# Altium schematic sheet Senior-Analog-batteryrecharge.SchDoc
size B
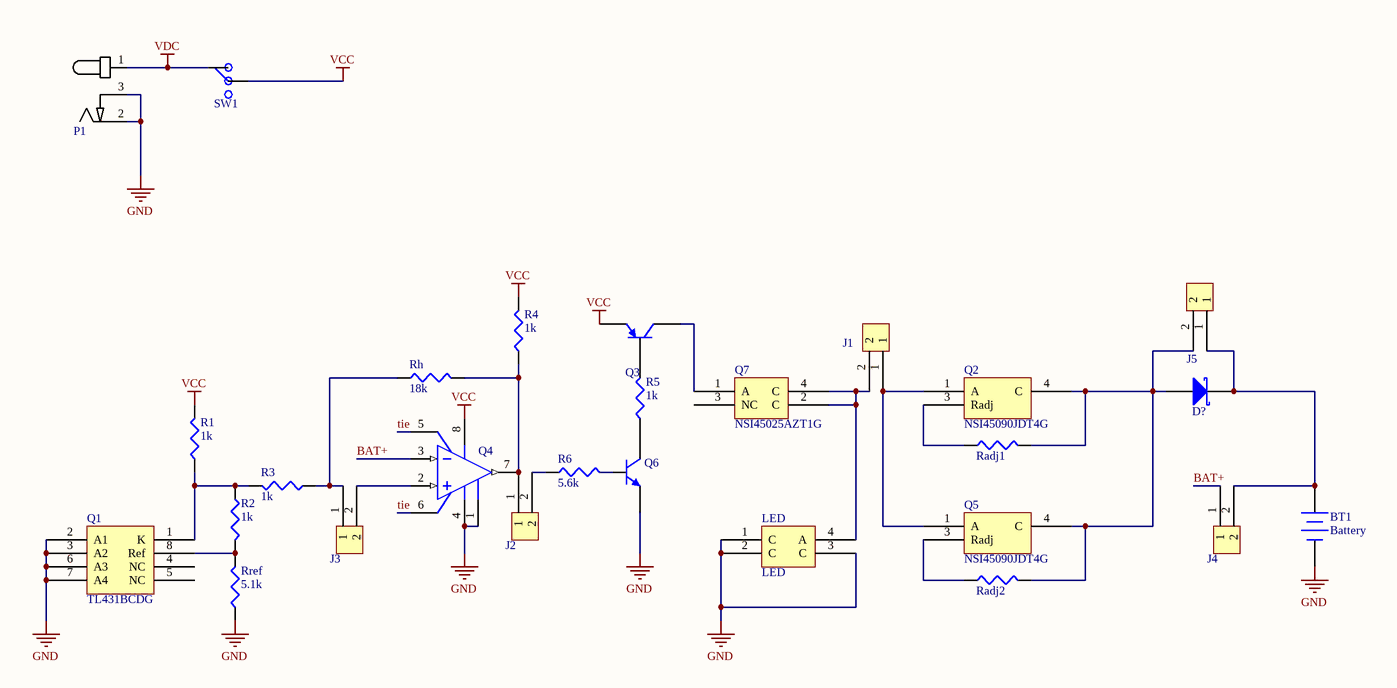
[diagram p0: Senior-Analog-batteryrecharge.SchDoc]

## Parts
BT1  Battery  [BAT-2]
D?  DB2J20600L  [SODFL250X70-2N]  (value not drawn)
J1  2-pin Jumper  [2-pin-jumper]  (value not drawn)
J2  2-pin Jumper  [2-pin-jumper]  (value not drawn)
J3  2-pin Jumper  [2-pin-jumper]  (value not drawn)
J4  2-pin Jumper  [2-pin-jumper]  (value not drawn)
J5  2-pin Jumper  [2-pin-jumper]  (value not drawn)
LED  LS E67B-S2V1-1-1-Z  [OSRAM_LED]  (value not drawn)
P1  PJ-002BH  [PJ-002BH]  (value not drawn)
Q1  TL431BCDG  [SOIC127P600X175-8N]
Q2  NSI45090JDT4G  [DPAK229P991X238-3N]
Q3  NSS40200LT1G  [SOT95P245X110-3N]  (value not drawn)
Q4  LM311DR2G  [SOIC127P600X175-8N]  (value not drawn)
Q5  NSI45090JDT4G  [DPAK229P991X238-3N]
Q6  MMBT3904LT3G  [SOT95P245X110-3N]  (value not drawn)
Q7  NSI45025AZT1G  [SOT230P700X180-4N]
R1  Resistance (Ohms): 1k  [R0805]  (hidden comment: RC0805FR-071KL)
R2  Resistance (Ohms): 1k  [R0805]  (hidden comment: RC0805FR-071KL)
R3  Resistance (Ohms): 1k  [R0805]  (hidden comment: RC0805FR-071KL)
R4  Resistance (Ohms): 1k  [R1206]  (hidden comment: RC1206FR-071KL)
R5  Resistance (Ohms): 1k  [R1206]  (hidden comment: RC1206FR-071KL)
R6  Resistance (Ohms): 5.6k  [R0805]  (hidden comment: RC0805FR-075K6L)
Radj1  R1210_generic  [R1210]  (value not drawn)
Radj2  R1210_generic  [R1210]  (value not drawn)
Rh  Resistance (Ohms): 18k  [R0805]  (hidden comment: RC0805FR-0718KL)
Rref  Resistance (Ohms): 5.1k  [R0805]  (hidden comment: RC0805FR-075K1L)
SW1  MS12ANW03  [SPDT SWITCH]  (value not drawn)

## Nets
GND: BT1.2(-) LED.1(C) LED.2(C) LED.3(C) P1.2 P1.3 Q1.2(A1) Q1.3(A2) Q1.6(A3) Q1.7(A4) Q4.1(GND) Q4.4(VEE) Q6.2(E) Rref.1
VCC: Q3.2(E) Q4.8(VCC) R1.2 R4.2 SW1.2(OUT)
VDC: P1.1 SW1.1(IN)
BAT+: J4.1 Q4.3(IN+)
tie: Q4.5(BAL) Q4.6(BAL)
NetBT1_1: BT1.1(+) D?.1(K) J4.2 J5.1
NetD?_2: D?.2(A) J5.2 Q2.4(C) Q5.4(C) Radj1.2 Radj2.2
NetJ1_1: J1.1 Q2.1(A) Q5.1(A)
NetJ1_2: J1.2 LED.4(A) Q7.2(C) Q7.4(C)
NetJ2_1: J2.1 Q4.7(Out) R4.1 Rh.2
NetJ2_2: J2.2 R6.1
NetJ3_1: J3.1 R3.1 Rh.1
NetJ3_2: J3.2 Q4.2(IN-)
NetQ1_1: Q1.1(K) R1.1 R2.1 R3.2
NetQ1_8: Q1.8(Ref) R2.2 Rref.2
NetQ2_3: Q2.3(Radj) Radj1.1
NetQ3_1: Q3.1(B) R5.2
NetQ3_3: Q3.3(C) Q7.1(A)
NetQ5_3: Q5.3(Radj) Radj2.1
NetQ6_1: Q6.1(B) R6.2
NetQ6_3: Q6.3(C) R5.1

Not connected (* = marked no-connect by the designer): Q1 4(NC) 5(NC); Q7 3(NC)

## Library data of the parts
BT1 = Battery: Multicell Battery; Published: 24-Mar-1999; LatestRevisionDate: 17-Jul-2002; LatestRevisionNote: Re-released for DXP Platform.; PackageReference: BAT-2; Publisher: Altium Limited; PackageDescription: Battery; 2 Leads
D? = DB2J20600L: DIODE SCHOTTKY 20V 1A SMINI2; Manufacturer: Panasonic Electronic Components; Voltage - Forward (Vf) (Max) @ If: 450mV @ 1A; Speed: Fast Recovery =< 500ns, > 200mA (Io); Reverse Recovery Time (trr): 6ns; Current - Reverse Leakage @ Vr: 100µA @ 20V; Capacitance @ Vr, F: 20pF @ 10V, 1MHz; Supplier 1: Digi-Key; Manufacturer Part Number: DB2J20600L; RoHS: RoHS Compliant; Category: Discrete Semiconductor Products; Stock 1: 1938; Pricing 1: 1=0.17, 10=0.145, 25=0.1168, 100=0.0909, 250=0.08828, 500=0.08566, 1000=0.07788 (USD); Packaging: Cut Tape (CT); Diode Type: Schottky; Voltage - DC Reverse (Vr) (Max): 20V; Current - Average Rectified (Io): 1A; Mounting Type: Surface Mount; Package / Case: SC-90, SOD-323F; Supplier Device Package: SMini2-F5-B; Operating Temperature - Junction: 150°C (Max); ComponentLink1URL: http://industrial.panasonic.com/www-cgi/jvcr13pz.cgi?E+SC+4+CDF7001+DB2J206+8+WW; ComponentLink1Description: http://industrial.panasonic.com/www-cgi/jvcr13pz.cgi?E+SC+4+CDF7001+DB2J206+8+WW; Supplier Part Number 1: DB2J20600LCT-ND
LED = LS E67B-S2V1-1-1-Z: LED RED CLEAR 4PLCC SMD; Manufacturer: OSRAM Opto Semiconductors Inc.; Lens Color: Colorless; Millicandela Rating: 562mcd; Lens Style/Size: Round with Flat Top, 2.40mm; Voltage - Forward (Vf) (Typ): 2.2V; Current - Test: 50mA; Viewing Angle: 120°; Wavelength - Dominant: 633nm; Wavelength - Peak: 645nm; Supplier 1: Digi-Key; Manufacturer Part Number: LS E67B-S2V1-1-1-Z; RoHS: RoHS Compliant; Category: Optoelectronics; Stock 1: 21300; Pricing 1: 1=0.41, 10=0.316, 25=0.2576, 100=0.2048, 250=0.17556, 500=0.15216, 1000=0.11705 (USD); Packaging: Cut Tape (CT); Color: Red; Lens Transparency: Clear; Mounting Type: Surface Mount; Features: -; Package / Case: 4-PLCC; Supplier Device Package: 4-PLCC; Size / Dimension: 3.20mm L x 2.80mm W; Height (Max): 2.10mm; ComponentLink1URL: http://www.osram-os.com/Graphics/XPic8/00090423_0.pdf; ComponentLink1Description: http://www.osram-os.com/Graphics/XPic8/00090423_0.pdf; Supplier Part Number 1: 475-2505-1-ND
P1 = PJ-002BH: CONN PWR JACK 2.5X5.5MM HIGH CUR; Manufacturer: CUI Inc.; Gender: Male; Plug/Mating Plug Diameter: 2.5mm ID, 5.5mm OD; Number of Positions/Contacts: 2 Conductors, 3 Contacts; Internal Switch(s): Single Switch, Normally Closed; Shielding: Unshielded; Voltage - Rated: 24VDC; Current Rating: 5A; Supplier 1: Digi-Key; Manufacturer Part Number: PJ-002BH; RoHS: RoHS Compliant; Category: Connectors, Interconnects; Stock 1: 55516; Pricing 1: 1=1.16, 10=0.812, 100=0.5452, 500=0.4408, 1000=0.3944, 2500=0.3132 (USD); Connector Type: Jack; Mounting Type: Through Hole, Right Angle; Termination: Solder Eyelet(s); Features: -; Color: Black; Contact Material: Copper Alloy; Contact Material - Plating: Nickel; Housing Color: Black; Housing Material: Thermoplastic; Operating Temperature: -25°C ~ 85°C; ComponentLink1URL: http://www.cui.com/product/resource/digikeypdf/pj-002bh.pdf; ComponentLink1Description: http://www.cui.com/product/resource/digikeypdf/pj-002bh.pdf; Supplier Part Number 1: CP-002BH-ND
Q1 = TL431BCDG: IC VREF SHUNT ADJ 8SOIC; Manufacturer: ON Semiconductor; Output Type: Adjustable; Voltage - Output (Min/Fixed): 2.495V; Voltage - Output (Max): 36V; Current - Output: 100mA; Tolerance: ±0.4%; Temperature Coefficient: 50ppm/°C Typical; Current - Cathode: 1mA; Supplier 1: Digi-Key; Manufacturer Part Number: TL431BCDG; RoHS: RoHS Compliant; Category: Integrated Circuits (ICs); Stock 1: 2292; Pricing 1: 1=0.47, 10=0.403, 100=0.301, 500=0.2365, 1000=0.18275 (USD); Packaging: Tube; Reference Type: Shunt; Noise - 0.1Hz to 10Hz: -; Noise - 10Hz to 10kHz: -; Voltage - Input: -; Current - Supply: -; Operating Temperature: 0°C ~ 70°C (TA); Mounting Type: Surface Mount; Package / Case: 8-SOIC (0.154", 3.90mm Width); Supplier Device Package: 8-SOIC; ComponentLink1URL: http://www.onsemi.com/pub_link/Collateral/TL431-D.PDF; ComponentLink1Description: http://www.onsemi.com/pub_link/Collateral/TL431-D.PDF; Supplier Part Number 1: TL431BCDGOS-ND
Q2 Q5 = NSI45090JDT4G: IC LED DRIVER/REG CCR DPAK; Manufacturer: ON Semiconductor; Function: Current Regulator; Sensing Method: High/Low-Side; Accuracy: ±15%; Voltage - Input: 45V; Current - Output: 160mA; Supplier 1: Digi-Key; Manufacturer Part Number: NSI45090JDT4G; RoHS: RoHS Compliant; Category: Integrated Circuits (ICs); Stock 1: 19703; Pricing 1: 1=0.89, 10=0.785, 100=0.6006, 500=0.47586, 1000=0.38115 (USD); Packaging: Cut Tape (CT); Operating Temperature: -55°C ~ 175°C; Mounting Type: Surface Mount; Package / Case: TO-252-3, DPak (2 Leads + Tab), SC-63; Supplier Device Package: DPAK-3; ComponentLink1URL: http://www.onsemi.com/pub_link/Collateral/NSI45090JD-D.PDF; ComponentLink1Description: http://www.onsemi.com/pub_link/Collateral/NSI45090JD-D.PDF; Supplier Part Number 1: NSI45090JDT4GOSCT-ND
Q3 = NSS40200LT1G: TRANS PNP 40V 2A SOT-23; Manufacturer: ON Semiconductor; Vce Saturation (Max) @ Ib, Ic: 170mV @ 200mA, 2A; Current - Collector Cutoff (Max): 100nA (ICBO); DC Current Gain (hFE) (Min) @ Ic, Vce: 220 @ 500mA, 2V; Power - Max: 460mW; Frequency - Transition: 100MHz; Supplier 1: Digi-Key; Manufacturer Part Number: NSS40200LT1G; RoHS: RoHS Compliant; Category: Discrete Semiconductor Products; Stock 1: 8418; Pricing 1: 1=0.4, 10=0.323, 100=0.2201, 500=0.16474, 1000=0.1234 (USD); Packaging: Cut Tape (CT); Transistor Type: PNP; Current - Collector (Ic) (Max): 2A; Voltage - Collector Emitter Breakdown (Max): 40V; Mounting Type: Surface Mount; Package / Case: TO-236-3, SC-59, SOT-23-3; Supplier Device Package: SOT-23-3 (TO-236); ComponentLink1URL: http://www.onsemi.com/pub_link/Collateral/NSS40200L-D.PDF; ComponentLink1Description: http://www.onsemi.com/pub_link/Collateral/NSS40200L-D.PDF; Supplier Part Number 1: NSS40200LT1GOSCT-ND
Q4 = LM311DR2G: IC COMPARATOR SGL HI VOLT 8SOIC; Manufacturer: ON Semiconductor; Type: General Purpose; Number of Elements: 1; Output Type: DTL, MOS, Open-Collector, Open-Emitter, RTL, TTL; Voltage - Supply, Single/Dual (±): 5 V ~ 30 V, ±2.5 V ~ 15 V; Voltage - Input Offset (Max): 7.5mV @ ±15V; Current - Input Bias (Max): 0.25µA @ ±15V; Current - Quiescent (Max): 7.5mA; Supplier 1: Digi-Key; Manufacturer Part Number: LM311DR2G; RoHS: RoHS Compliant; Category: Integrated Circuits (ICs); Stock 1: 6693; Pricing 1: 1=0.47, 10=0.401, 100=0.2991, 500=0.23494, 1000=0.18113 (USD); Packaging: Cut Tape (CT); Current - Output (Typ): -; CMRR, PSRR (Typ): -; Propagation Delay (Max): -; Hysteresis: -; Operating Temperature: 0°C ~ 70°C; Package / Case: 8-SOIC (0.154", 3.90mm Width); Mounting Type: Surface Mount; Supplier Device Package: 8-SOIC; ComponentLink1URL: http://www.onsemi.com/pub_link/Collateral/LM211-D.PDF; ComponentLink1Description: http://www.onsemi.com/pub_link/Collateral/LM211-D.PDF; Supplier Part Number 1: LM311DR2GOSCT-ND
Q6 = MMBT3904LT3G: TRANS NPN 40V 0.2A SOT23; Manufacturer: ON Semiconductor; Current - Collector (Ic) (Max): 200mA; Vce Saturation (Max) @ Ib, Ic: 300mV @ 5mA, 50mA; DC Current Gain (hFE) (Min) @ Ic, Vce: 100 @ 10mA, 1V; Power - Max: 300mW; Frequency - Transition: 300MHz; Supplier 1: Digi-Key; Manufacturer Part Number: MMBT3904LT3G; RoHS: RoHS Compliant; Category: Discrete Semiconductor Products; Stock 1: 220109; Pricing 1: 1=0.11, 10=0.097, 100=0.0531, 500=0.03262, 1000=0.02225 (USD); Packaging: Cut Tape (CT); Transistor Type: NPN; Voltage - Collector Emitter Breakdown (Max): 40V; Current - Collector Cutoff (Max): -; Mounting Type: Surface Mount; Package / Case: TO-236-3, SC-59, SOT-23-3; Supplier Device Package: SOT-23-3 (TO-236); ComponentLink1URL: http://www.onsemi.com/pub_link/Collateral/MMBT3904LT1-D.PDF; ComponentLink1Description: http://www.onsemi.com/pub_link/Collateral/MMBT3904LT1-D.PDF; Supplier Part Number 1: MMBT3904LT3GOSCT-ND
Q7 = NSI45025AZT1G: IC LED DRIVER LINEAR SOT-223; Manufacturer: ON Semiconductor; Function: Current Regulator; Sensing Method: High/Low-Side; Accuracy: ±10%; Voltage - Input: 45V; Current - Output: 25mA; Supplier 1: Digi-Key; Manufacturer Part Number: NSI45025AZT1G; RoHS: RoHS Compliant; Category: Integrated Circuits (ICs); Stock 1: 8510; Pricing 1: 1=0.6, 10=0.511, 100=0.3815, 500=0.29964 (USD); Packaging: Cut Tape (CT); Operating Temperature: -55°C ~ 150°C; Mounting Type: Surface Mount; Package / Case: TO-261-4, TO-261AA; Supplier Device Package: SOT-223; ComponentLink1URL: http://www.onsemi.com/pub_link/Collateral/NSI45025AZ-D.PDF; ComponentLink1Description: http://www.onsemi.com/pub_link/Collateral/NSI45025AZ-D.PDF; Supplier Part Number 1: NSI45025AZT1GOSCT-ND
R1-R3 = RC0805FR-071KL: RES SMD 1K OHM 1% 1/8W 0805; Manufacturer: Yageo; Power (Watts): 0.125W, 1/8W; Temperature Coefficient: ±100ppm/°C; Supplier 1: Digi-Key; Manufacturer Part Number: RC0805FR-071KL; RoHS: RoHS Compliant; Category: Resistors; Stock 1: 1831476; Pricing 1: 1=0.1, 10=0.021, 25=0.0152, 100=0.0084, 250=0.00644, 500=0.00514, 1000=0.00379, 2500=0.00329 (USD); Packaging: Cut Tape (CT); Tolerance: ±1%; Composition: Thick Film; Features: Moisture Resistant; Operating Temperature: -55°C ~ 155°C; Package / Case: 0805 (2012 Metric); Supplier Device Package: 0805; Size / Dimension: 0.079" L x 0.049" W (2.00mm x 1.25mm); Height: 0.024" (0.60mm); Number of Terminations: 2; ComponentLink1URL: http://www.yageo.com/documents/recent/PYu-RC_Group_51_RoHS_L_04.pdf; ComponentLink1Description: http://www.yageo.com/documents/recent/PYu-RC_Group_51_RoHS_L_04.pdf; Supplier Part Number 1: 311-1.00KCRCT-ND
R4 R5 = RC1206FR-071KL: RES SMD 1K OHM 1% 1/4W 1206; Manufacturer: Yageo; Power (Watts): 0.25W, 1/4W; Temperature Coefficient: ±100ppm/°C; Supplier 1: Digi-Key; Manufacturer Part Number: RC1206FR-071KL; RoHS: RoHS Compliant; Category: Resistors; Stock 1: 593259; Pricing 1: 1=0.1, 10=0.032, 25=0.0232, 100=0.013, 250=0.00992, 500=0.00792, 1000=0.00583, 2500=0.00506 (USD); Packaging: Cut Tape (CT); Tolerance: ±1%; Composition: Thick Film; Features: Moisture Resistant; Operating Temperature: -55°C ~ 155°C; Package / Case: 1206 (3216 Metric); Supplier Device Package: 1206; Size / Dimension: 0.122" L x 0.063" W (3.10mm x 1.60mm); Height: 0.026" (0.65mm); Number of Terminations: 2; ComponentLink1URL: http://www.yageo.com/documents/recent/PYu-RC_Group_51_RoHS_L_04.pdf; ComponentLink1Description: http://www.yageo.com/documents/recent/PYu-RC_Group_51_RoHS_L_04.pdf; Supplier Part Number 1: 311-1.00KFRCT-ND
R6 = RC0805FR-075K6L: RES SMD 5.6K OHM 1% 1/8W 0805; Manufacturer: Yageo; Power (Watts): 0.125W, 1/8W; Temperature Coefficient: ±100ppm/°C; Supplier 1: Digi-Key; Manufacturer Part Number: RC0805FR-075K6L; RoHS: RoHS Compliant; Category: Resistors; Stock 1: 192512; Pricing 1: 1=0.1, 10=0.021, 25=0.0152, 100=0.0084, 250=0.00644, 500=0.00514, 1000=0.00379, 2500=0.00329 (USD); Packaging: Cut Tape (CT); Tolerance: ±1%; Composition: Thick Film; Features: Moisture Resistant; Operating Temperature: -55°C ~ 155°C; Package / Case: 0805 (2012 Metric); Supplier Device Package: 0805; Size / Dimension: 0.079" L x 0.049" W (2.00mm x 1.25mm); Height: 0.024" (0.60mm); Number of Terminations: 2; ComponentLink1URL: http://www.yageo.com/documents/recent/PYu-RC_Group_51_RoHS_L_04.pdf; ComponentLink1Description: http://www.yageo.com/documents/recent/PYu-RC_Group_51_RoHS_L_04.pdf; Supplier Part Number 1: 311-5.60KCRCT-ND
Rh = RC0805FR-0718KL: RES SMD 18K OHM 1% 1/8W 0805; Manufacturer: Yageo; Power (Watts): 0.125W, 1/8W; Temperature Coefficient: ±100ppm/°C; Supplier 1: Digi-Key; Manufacturer Part Number: RC0805FR-0718KL; RoHS: RoHS Compliant; Category: Resistors; Stock 1: 83987; Pricing 1: 1=0.1, 10=0.021, 25=0.0152, 100=0.0084, 250=0.00644, 500=0.00514, 1000=0.00379, 2500=0.00329 (USD); Packaging: Cut Tape (CT); Tolerance: ±1%; Composition: Thick Film; Features: Moisture Resistant; Operating Temperature: -55°C ~ 155°C; Package / Case: 0805 (2012 Metric); Supplier Device Package: 0805; Size / Dimension: 0.079" L x 0.049" W (2.00mm x 1.25mm); Height: 0.024" (0.60mm); Number of Terminations: 2; ComponentLink1URL: http://www.yageo.com/documents/recent/PYu-RC_Group_51_RoHS_L_04.pdf; ComponentLink1Description: http://www.yageo.com/documents/recent/PYu-RC_Group_51_RoHS_L_04.pdf; Supplier Part Number 1: 311-18.0KCRCT-ND
Rref = RC0805FR-075K1L: RES SMD 5.1K OHM 1% 1/8W 0805; Manufacturer: Yageo; Power (Watts): 0.125W, 1/8W; Temperature Coefficient: ±100ppm/°C; Supplier 1: Digi-Key; Manufacturer Part Number: RC0805FR-075K1L; RoHS: RoHS Compliant; Category: Resistors; Stock 1: 110186; Pricing 1: 1=0.1, 10=0.021, 25=0.0152, 100=0.0084, 250=0.00644, 500=0.00514, 1000=0.00379, 2500=0.00329 (USD); Packaging: Cut Tape (CT); Tolerance: ±1%; Composition: Thick Film; Features: Moisture Resistant; Operating Temperature: -55°C ~ 155°C; Package / Case: 0805 (2012 Metric); Supplier Device Package: 0805; Size / Dimension: 0.079" L x 0.049" W (2.00mm x 1.25mm); Height: 0.024" (0.60mm); Number of Terminations: 2; ComponentLink1URL: http://www.yageo.com/documents/recent/PYu-RC_Group_51_RoHS_L_04.pdf; ComponentLink1Description: http://www.yageo.com/documents/recent/PYu-RC_Group_51_RoHS_L_04.pdf; Supplier Part Number 1: 311-5.10KCRCT-ND
SW1 = MS12ANW03: SWITCH SLIDE SPDT 6A 125V; Manufacturer: NKK Switches; Contact Timing: Non-Shorting (BBM); Switch Function: On-On; Current Rating: 6A (AC); Actuator Type: Standard; Actuator Length: 5.10mm; Actuator Material: Polybutylene Terephthalate (PBT), Glass Filled; Switch Travel: 2.20mm; Mechanical Life: 100,000 Cycles; Electrical Life: 25,000 Cycles; Supplier 1: Digi-Key; Manufacturer Part Number: MS12ANW03; RoHS: RoHS Compliant; Category: Switches; Stock 1: 1580; Pricing 1: 1=3.41, 10=3.266, 50=2.769, 100=2.698, 250=2.66252, 500=2.201, 1000=2.059, 5000=1.917 (USD); Packaging: Bulk; Circuit: SPDT; Voltage Rating - AC: 125V; Voltage Rating - DC: -; Contact Material: Silver Alloy; Contact Finish: Silver; Mounting Type: Through Hole; Termination Style: PC Pin; Features: Epoxy Sealed Terminals; Operating Temperature: -30°C ~ 85°C; Operating Force: -; ComponentLink1URL: http://www.nkkswitches.com/pdf/MSnonilluminated.pdf; ComponentLink1Description: http://www.nkkswitches.com/pdf/MSnonilluminated.pdf; Supplier Part Number 1: 360-2385-ND